# Altium schematic sheet Display.SchDoc: Displays
size A4; CheckedBy: D. Actis Grosso; Author: Simone C.; DocumentNumber: 3; Revision: 1.3; SheetNumber: 3; SheetTotal: 3
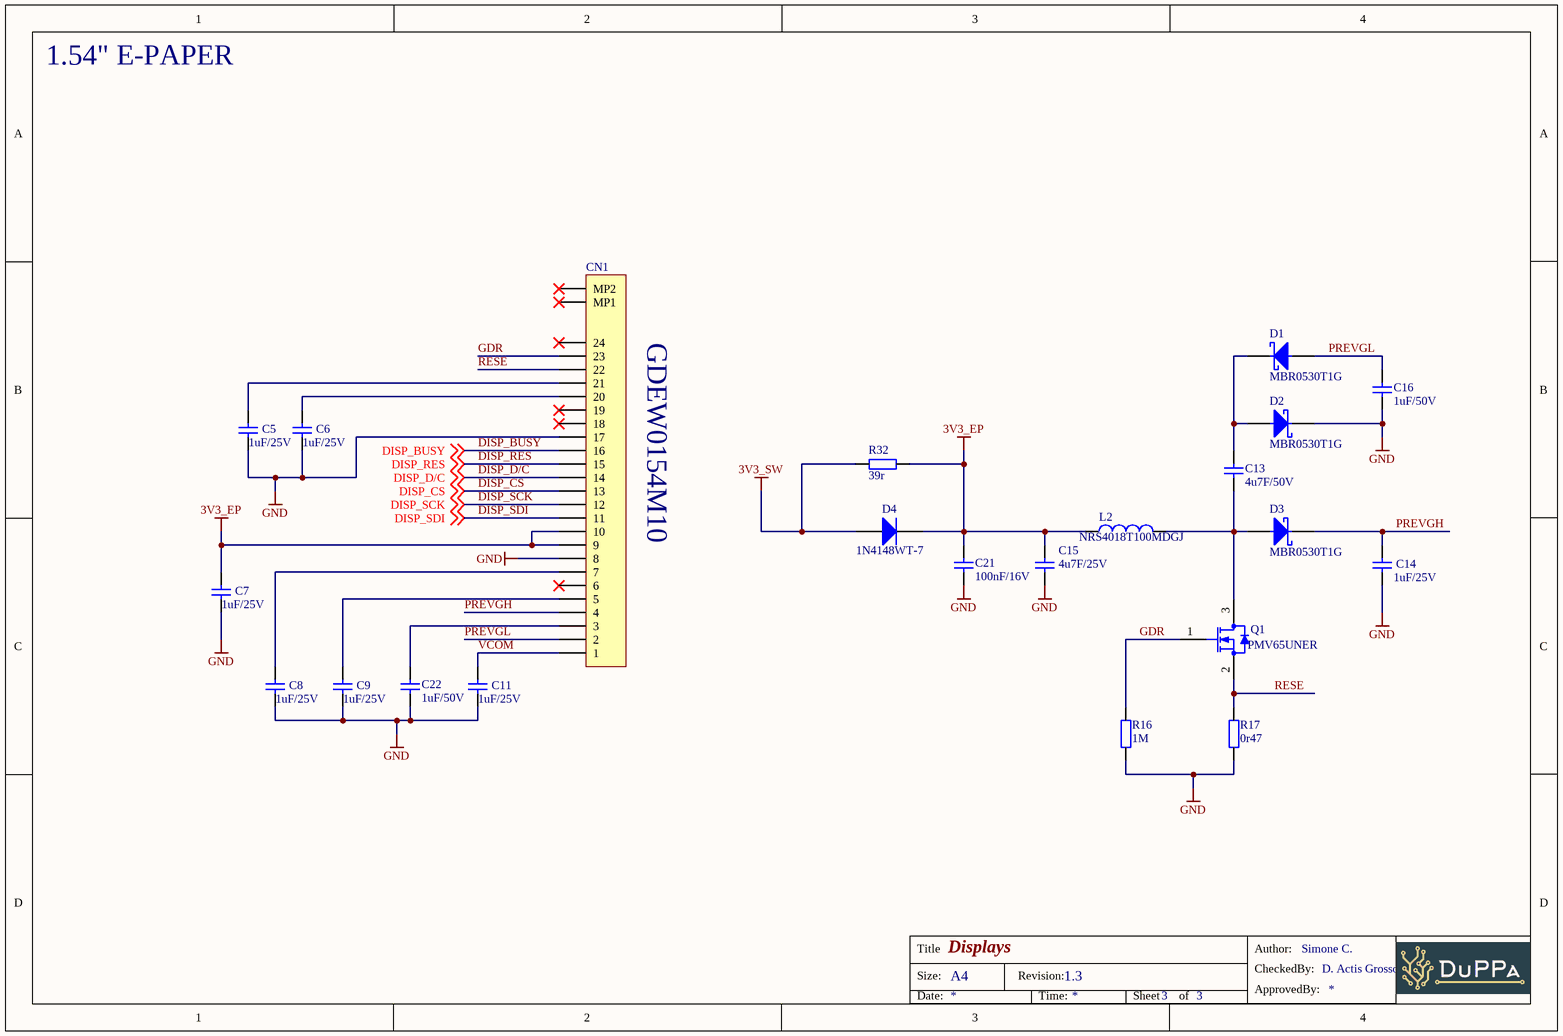
[diagram p0: Display.SchDoc]

## Parts
C5  value 1uF/25V  [C0402]  (hidden comment: Cap_0402_1uF/25V)
C6  value 1uF/25V  [C0402]  (hidden comment: Cap_0402_1uF/25V)
C7  value 1uF/25V  [C0402]  (hidden comment: Cap_0402_1uF/25V)
C8  value 1uF/25V  [C0402]  (hidden comment: Cap_0402_1uF/25V)
C9  value 1uF/25V  [C0402]  (hidden comment: Cap_0402_1uF/25V)
C11  value 1uF/25V  [C0402]  (hidden comment: Cap_0402_1uF/25V)
C13  value 4u7F/50V  [C0805]  (hidden comment: Cap_0805_4u7F/50V)
C14  value 1uF/25V  [C0402]  (hidden comment: Cap_0402_1uF/25V)
C15  value 4u7F/25V  [C0603]  (hidden comment: Cap_0603_4u7F/35V)
C16  value 1uF/50V  [C0603]  (hidden comment: Cap_0603_1uF/50V)
C21  value 100nF/16V  [C0402]  (hidden comment: Cap_0402_100n/16V)
C22  value 1uF/50V  [C0603]  (hidden comment: Cap_0603_1uF/50V)
CN1  F3311A7H121024E200  [F3311A7H121024E200]  (value not drawn)
D1  MBR0530T1G  [FP-SOD123-MFG]
D2  MBR0530T1G  [FP-SOD123-MFG]
D3  MBR0530T1G  [FP-SOD123-MFG]
D4  PartNumber: 1N4148WT-7  [SODFL160X65-2N]  (hidden comment: Diode_1N4148WT)
L2  Part Number: NRS4018T100MDGJ  [FP-NRS4018-MFG]  (hidden comment: 10uH_1.44A_NRS4018T100MDGJ)
Q1  PMV65UNER  [SOT-23-3]
R16  value 1M  [R0402]  (hidden comment: R_R0402_1M)
R17  value 0r47  [R0402]  (hidden comment: R_R0402_0r47)
R32  value 39r  [R0402]  (hidden comment: R_R0402_39r)

## Nets
3V3_EP: C7.1 C15.1 C21.1 CN1.9 CN1.10 D4.K L2.1 R32.2
3V3_SW: D4.A R32.1
GND: C5.2 C6.2 C7.2 C8.2 C9.2 C11.2 C14.2 C15.2 C16.2 C21.2 C22.2 CN1.8 CN1.17 D2.K R16.1 R17.1
DISP_BUSY: CN1.16 ; off-sheet DISP_BUSY
DISP_CS: CN1.13 ; off-sheet DISP_CS
DISP_D/C: CN1.14 ; off-sheet DISP_D/C
DISP_RES: CN1.15 ; off-sheet DISP_RES
DISP_SCK: CN1.12 ; off-sheet DISP_SCK
DISP_SDI: CN1.11 ; off-sheet DISP_SDI
GDR: CN1.23 Q1.1(G) R16.2
PREVGH: C14.1 CN1.4 D3.K
PREVGL: C16.1 CN1.2 D1.A
RESE: CN1.22 Q1.2(S) R17.2
VCOM: C11.1 CN1.1
NetC5_1: C5.1 CN1.21
NetC6_1: C6.1 CN1.20
NetC8_1: C8.1 CN1.7
NetC9_1: C9.1 CN1.5
NetC13_1: C13.1 D1.K D2.A
NetC13_2: C13.2 D3.A L2.2 Q1.3(D)
NetC22_1: C22.1 CN1.3

Not connected (* = marked no-connect by the designer): CN1 6* 18* 19* 24* MP1* MP2*

## Notes on the sheet
- 1.54" E-PAPER
- GDEW0154M10
- Title
- Size:
- A4
- Revision:
- Author:
- CheckedBy:
- Date:
- Time:
- Sheet
- of
- ApprovedBy:

## Library data of the parts
C5-C9 C11 C14 = Cap_0402_1uF/25V: 1uF ±10% 25V Ceramic Capacitor X5R 0402; PartNumber: CL05A105KA5NQNC; Manufacturer: Samsung Electro-Mechanics; Case/Package: 0402; LCSC: C52923; LCSC_Alt_1: C7393852; LCSC_Alt_2: C7472946; Voltage Rating: 25V
C13 = Cap_0805_4u7F/50V: 4.7uF ±10% 50V Ceramic Capacitor X5R 0805; PartNumber: HGC0805R5475K500NSLJ; Case/Package: 0805; LCSC: C7472969; Voltage Rating: 50V; LCSC_Alt_1: C513770; LCSC_Alt_2: C2903668
C15 = Cap_0603_4u7F/35V: 4.7uF ±10% 35V Ceramic Capacitor X5R 0603; PartNumber: CL10A475KL8NRNC; Manufacturer: Samsung Electro-Mechanics; Case/Package: 0603; LCSC: C307467; Voltage Rating: 35V; LCSC_Alt_1: C6119851; LCSC_Alt_2: C22367829
C16 C22 = Cap_0603_1uF/50V: 50V 1uF X5R ±10% 0603 Ceramic Capacitors ROHS; PartNumber: CL10A105KB8NNNC; Manufacturer: Samsung Electro-Mechanics; Case/Package: 0603; LCSC: C15849; Voltage Rating: 50V; LCSC_Alt_1: C6119852; LCSC_Alt_2: C380313
C21 = Cap_0402_100n/16V: 16V 100nF X7R ±10% 0402 Multilayer Ceramic Capacitors MLCC - SMD/SMT ROHS; PartNumber: CL05B104KO5NNNC; Manufacturer: Samsung Electro-Mechanics; Case/Package: 0402; LCSC: C1525; Voltage Rating: 16V; LCSC_Alt_1: C22435936; LCSC_Alt_2: C576716
CN1 = F3311A7H121024E200: FFC/FPC Connector 24 Position 0.5mm Pitch Double-Sided Contacts, Top and Bottom Entry Surface Mount, Right Angle -55℃~+85℃; Manufacturer: Amphenol ICC / FCI; Number of Contacts: 24P; LCSC_Alt_1: C52722656; LCSC_Alt_2: C48678015; LCSC: C3168055; Mount: SMD; Number of Positions: 24P; Number of Rows: 1; Orientation: Righht; PartNumber: F3311A7H121024E200; Pitch: 0.5mm
D1-D3 = MBR0530T1G: Diode 30V 500mA Surface Mount SOD-123; Manufacturer: Onsemi; PartNumber: MBR0530T1G; Package: SOD-123; LCSC: C82046; LCSC_Alt_1: C5204746; LCSC_Alt_2: C236079
D4 = Diode_1N4148WT: Diode Independent 80V 125mA Surface Mount SOD-523; Manufacturer: Diodes; Category: Rectifier Diodes; Case/Package: SOD-523; LCSC_Alt_1: C727112; LCSC_Alt_2: C5381437; LCSC: C83482
L2 = 10uH_1.44A_NRS4018T100MDGJ: 1.2A 10uH ±20% 1.3A 150mΩ SMD,4x4mm Fixed Inductors RoHS; Manufacturer: Taiyo Yuden; Saturation Current: 1.3A; Package: 4018; LCSC_Alt_1: C2041931; LCSC: C222882; Value: 10uH
Q1 = PMV65UNER: N-Channel 20V 2.8A 940mW Surface Mount SOT-23; Manufacturer: Nexperia; Category: MOSFETs; PartNumber: PMV65UNER; LCSC: C179446
R16 = R_R0402_1M: 1MΩ ±1% 62.5mW 0402 Thick Film Resistor; PartNumber: 0402WGF1004TCE; Manufacturer: UNI-ROYAL; LCSC: C26083; Case/Package: 0402; LCSC_Alt_1: C2909328; LCSC_Alt_2: C2770623; Tolerance: 1%
R17 = R_R0402_0r47: 0402, 1% ,63mW; PartNumber: RL0402JR-070R47L; LCSC: C423162; Case/Package: 0402
R32 = R_R0402_39R: 39Ω ±1% 62.5mW 0402 Thick Film Resistor; PartNumber: 0402WGF390JTCE; Manufacturer: UNI-ROYAL; LCSC: C25110; Case/Package: 0402; LCSC_Alt_1: C2770700; LCSC_Alt_2: C2909354; Tolerance: 1%